# Altium schematic sheet Power_Distribution.SchDoc
size A3; SheetNumber: 2; SheetTotal: 2
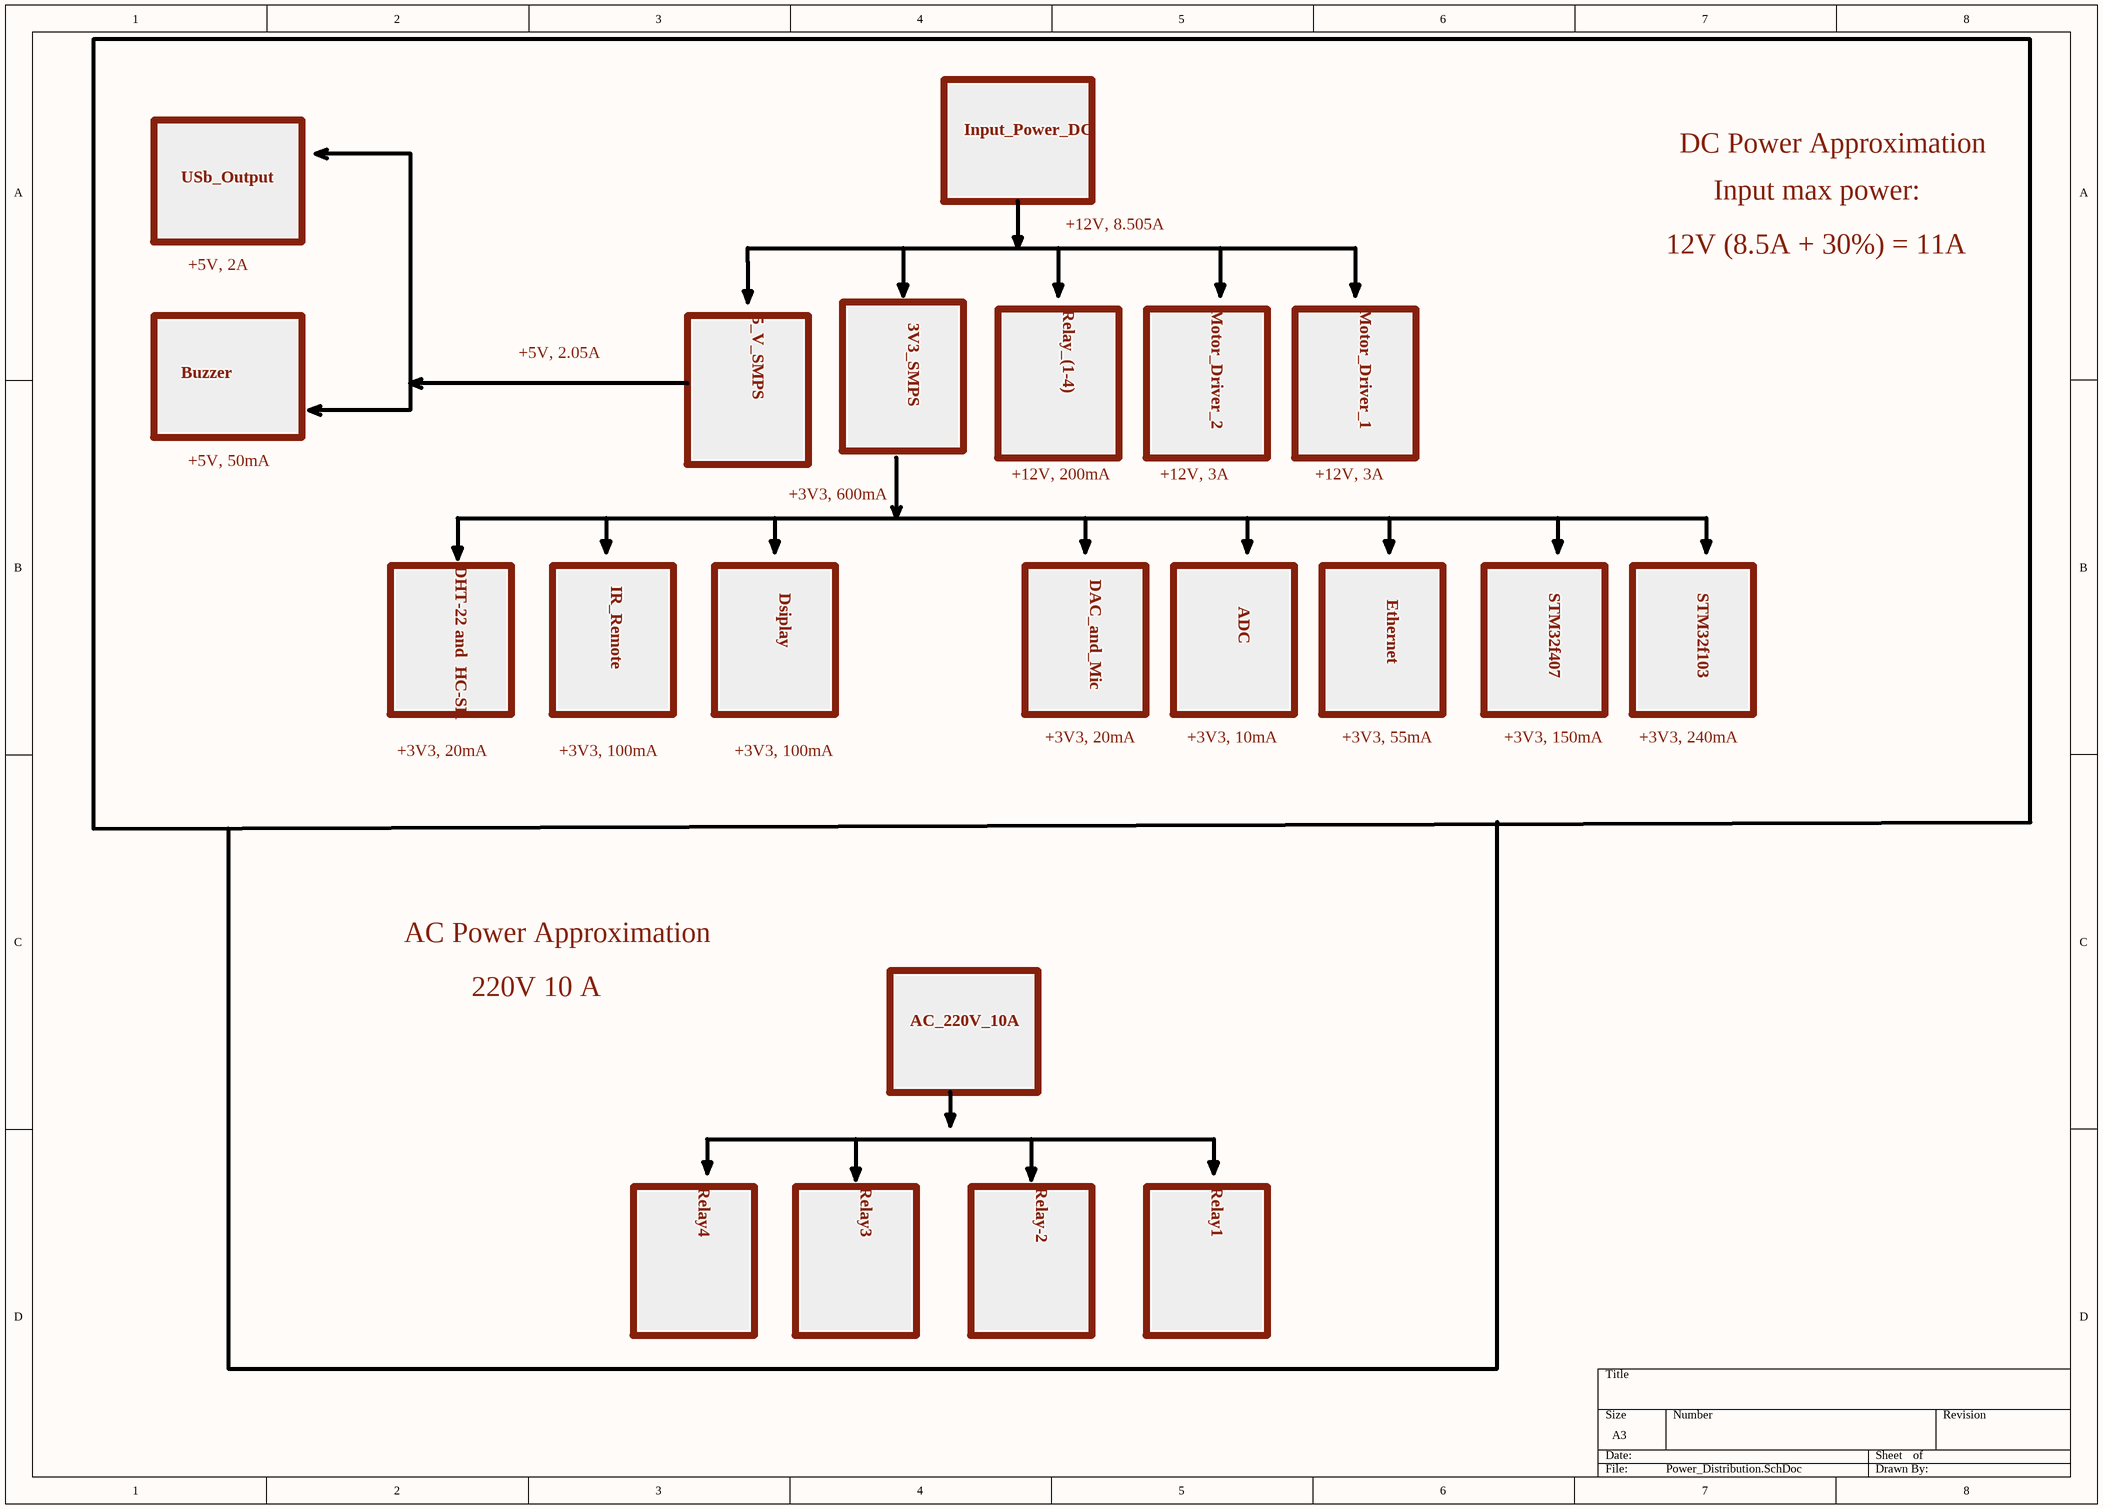
[diagram p0: Power_Distribution.SchDoc]

## Notes on the sheet
- USb_Output
- Input_Power_DC
- DC Power Approximation
- +12V, 8.505A
- Input max power:
- +5V, 2A
- 5_V_SMPS
- 3V3_SMPS
- Relay_(1-4)
- Motor_Driver_2
- Motor_Driver_1
- 12V (8.5A + 30%) = 11A
- Buzzer
- +5V, 2.05A
- +5V, 50mA
- +3V3, 600mA
- +12V, 200mA
- +12V, 3A
- DHT-22 and  HC-SR
- IR_Remote
- Dsiplay
- DAC_and_Mic
- STM32f407
- STM32f103
- ADC
- Ethernet
- +3V3, 20mA
- +3V3, 100mA
- +3V3, 10mA
- +3V3, 55mA
- +3V3, 150mA
- +3V3, 240mA
- AC Power Approximation
- 220V 10 A
- AC_220V_10A
- Relay4
- Relay3
- Relay-2
- Relay1